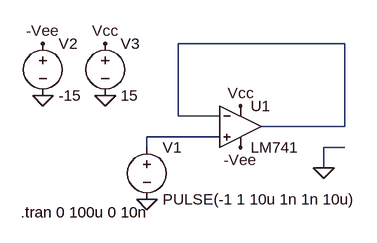
[diagram p0: schematic slewrate check.asc]
slewrate check.asc, the LTspice schematic file:
Version 4
SHEET 1 880 680
WIRE 368 32 112 32
WIRE 112 144 112 32
WIRE 176 144 112 144
WIRE 368 160 368 32
WIRE 368 160 240 160
WIRE 176 176 64 176
WIRE 64 192 64 176
WIRE 368 192 336 192
WIRE 336 224 336 192
FLAG 336 224 0
FLAG -96 112 0
FLAG 0 112 0
FLAG 0 32 Vcc
FLAG -96 32 -Vee
FLAG 208 128 Vcc
FLAG 208 192 -Vee
FLAG 64 272 0
SYMBOL OpAmps\\LM741 208 96 R0
SYMATTR InstName U1
SYMBOL voltage 64 176 R0
WINDOW 123 0 0 Left 0
WINDOW 39 0 0 Left 0
SYMATTR InstName V1
SYMATTR Value PULSE(-1 1 10u 1n 1n 10u)
SYMBOL voltage -96 16 R0
WINDOW 123 0 0 Left 0
WINDOW 39 0 0 Left 0
SYMATTR InstName V2
SYMATTR Value -15
SYMBOL voltage 0 16 R0
WINDOW 123 0 0 Left 0
WINDOW 39 0 0 Left 0
SYMATTR InstName V3
SYMATTR Value 15
TEXT -130 292 Left 2 !.tran 0 100u 0 10n

The netlist it stands for:
* slewrate check.asc
XU1 N002 N001 Vcc -Vee N001 LM741  ; pins In+ In- V+ V- OUT
V1 N002 0 PULSE(-1 1 10u 1n 1n 10u)
V2 -Vee 0 -15
V3 Vcc 0 15
.tran 0 100u 0 10n
.lib LM741.lib
.backanno
.end